# Altium schematic sheet controller.SchDoc
size A4; SheetNumber: 2; SheetTotal: 3; SPICEModelCacheHKYVZYBW: <root> / <DocumentId>HKYVZYBW</DocumentId> / </root>
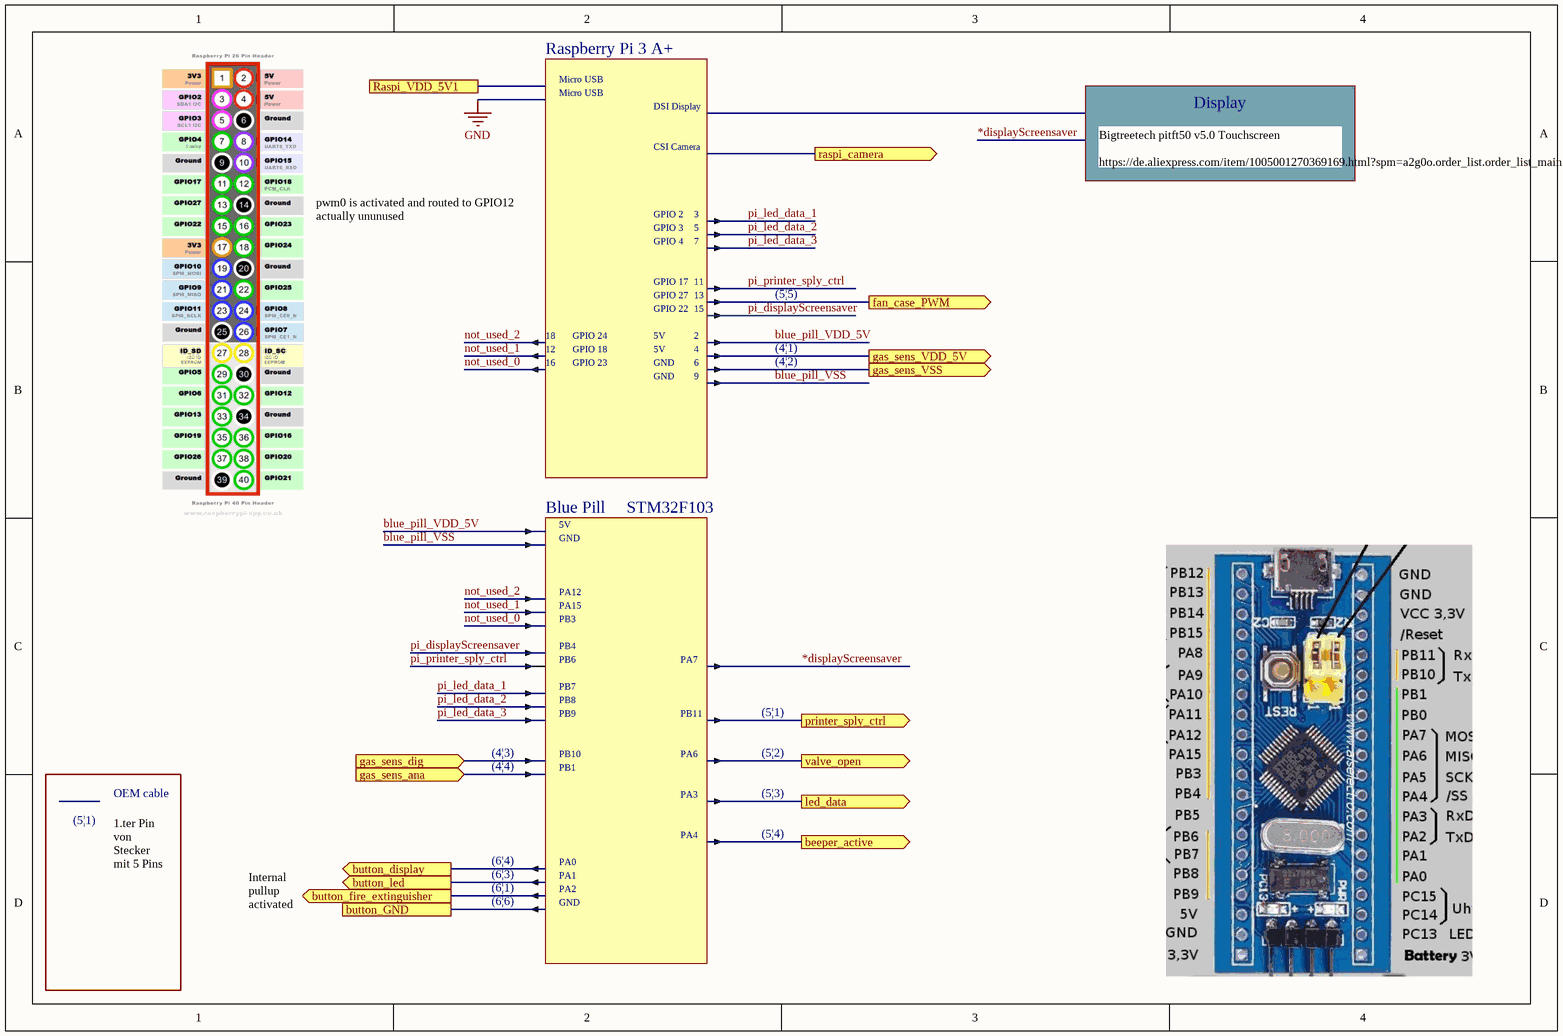
[diagram p0: controller.SchDoc]

## Ports
beeper_active (out), button_display (out), button_fire_extinguisher (out), button_GND, button_led (out), fan_case_PWM (out), gas_sens_ana (in), gas_sens_dig (in), gas_sens_VDD_5V (out), gas_sens_VSS (out), led_data (out), printer_sply_ctrl (out), raspi_camera (out), Raspi_VDD_5V1, valve_open (out)

## Notes on the sheet
- Raspberry Pi 3 A+
- Micro USB
- DSI Display
- Display
- CSI Camera
- Bigtreetech pitft50 v5.0 Touchscreen
  https://de.aliexpress.com/item/1005001270369169.html?spm=a2g0o.order_list.order_list_main.5.4e665c5flnb7hc&gatewayAdapt=glo2deu
- pwm0 is activated and routed to GPIO12
  actually ununused
- GPIO 2
- GPIO 3
- GPIO 4
- 3
- 5
- 7
- GPIO 17
- GPIO 27
- GPIO 22
- 11
- 13
- 15
- (5|5)
- 18
- 12
- 16
- GPIO 24
- GPIO 18
- GPIO 23
- 5V
- GND
- 2
- 9
- 6
- 4
- (4|1)
- (4|2)
- Blue Pill
- STM32F103
- PB4
- PB3
- PA15
- PA12
- PB7
- PB8
- PB9
- PB6
- PB11
- PA7
- (5|1)
- (4|3)
- (4|4)
- PB10
- PB1
- PA6
- (5|2)
- OEM cable
- PA4
- PA3
- (5|3)
- (5|4)
- 1.ter Pin von Stecker mit 5 Pins
- Internal pullup activated
- (6|1)
- (6|3)
- (6|4)
- (6|6)
- PA0
- PA1
- PA2